# EAGLE design untitled (EAGLE 9.5.2)
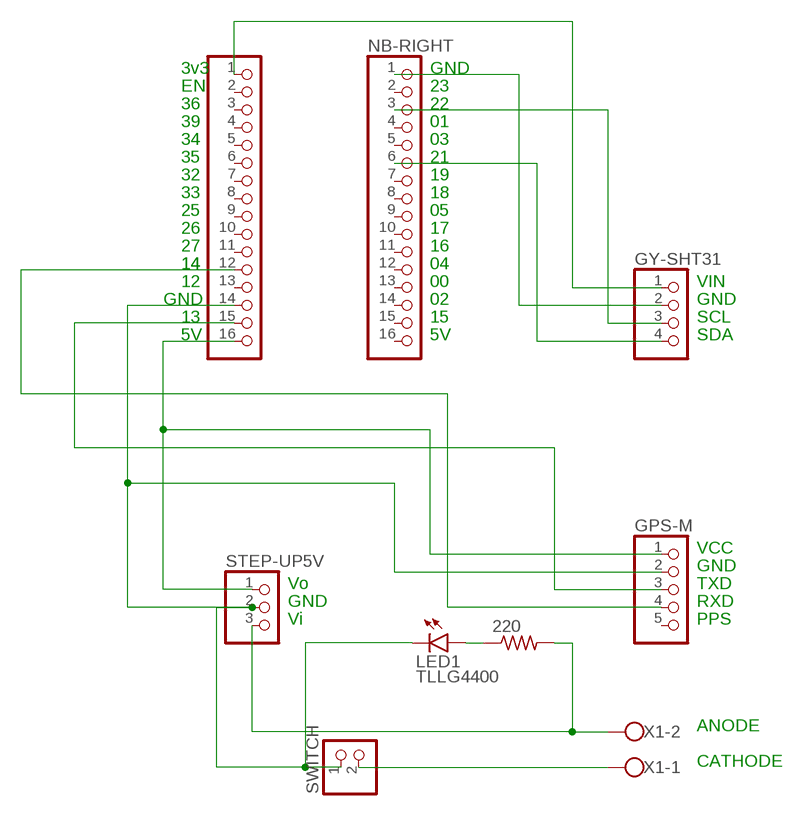
[diagram p0: schematic, sheet 1]

## Parts
220  R-US_0204/7  [0204/7]
GPS-M  PINHD-1X5  [1X05]
GY-SHT31  PINHD-1X4  [1X04]
LED1  TLLG4400  [LED3MM]
NB-LEFT  PINHD-1X16  [1X16]
NB-RIGHT  PINHD-1X16  [1X16]
STEP-UP5V  PINHD-1X3  [1X03]
SWITCH  PINHD-1X2  [1X02]
X1  W237-102  [W237-102]

## Nets
N$1: SWITCH.2 X1.1
N$2: 220.1 LED1.A
N$3: 220.2 STEP-UP5V.3 X1.2
N$4: GPS-M.2 LED1.K(C) NB-LEFT.14 STEP-UP5V.2 SWITCH.1
N$5: GY-SHT31.4 NB-RIGHT.6
N$6: GPS-M.1 NB-LEFT.16 STEP-UP5V.1
N$7: GPS-M.3 NB-LEFT.15
N$8: GPS-M.4 NB-LEFT.12
N$9: GY-SHT31.1 NB-LEFT.1
N$10: GY-SHT31.3 NB-RIGHT.3
N$11: GY-SHT31.2 NB-RIGHT.1
Unconnected: GPS-M.5 NB-LEFT.2 NB-LEFT.3 NB-LEFT.4 NB-LEFT.5 NB-LEFT.6 NB-LEFT.7 NB-LEFT.8 NB-LEFT.9 NB-LEFT.10 NB-LEFT.11 NB-LEFT.13 NB-RIGHT.2 NB-RIGHT.4 NB-RIGHT.5 NB-RIGHT.7 NB-RIGHT.8 NB-RIGHT.9 NB-RIGHT.10 NB-RIGHT.11 NB-RIGHT.12 NB-RIGHT.13 NB-RIGHT.14 NB-RIGHT.15 NB-RIGHT.16

## Notes on the sheet
- 3v3 | GND
- EN | 23
- 36 | 22
- 39 | 01
- 34 | 03
- 35 | 21
- 32 | 19
- 33 | 18
- 25 | 05
- 26 | 17
- 27 | 16
- 14 | 14 | 04
- 12 | 00 | VIN
- GND | 02 | GND
- 13 | 15 | SCL
- 5V | 5V | SDA
- VCC
- GND
- Vo | TXD
- GND | RXD
- Vi | PPS
- ANODE
- CATHODE

## Library data of the parts
220 = rcl:R-US_: RESISTOR, American symbol; SPICEPREFIX: R
GPS-M = pinhead:PINHD-1X5: PIN HEADER
GY-SHT31 = pinhead:PINHD-1X4: PIN HEADER
LED1 = led:TLLG4400: Low Current (2mA) LED 3 mm Tinted Diffused Package color GREEN Source: Data sheet <http://www.farnell.com/datasheets/391098.pdf>; MF: VISHAY SEMICONDUCTOR; OC_FARNELL: 1612435
NB-LEFT NB-RIGHT = pinhead:PINHD-1X16: PIN HEADER
STEP-UP5V = pinhead:PINHD-1X3: PIN HEADER
SWITCH = pinhead:PINHD-1X2: PIN HEADER
X1 = con-wago-500:W237-102: WAGO SCREW CLAMP; MPN: 237-102; OC_FARNELL: unknown; OC_NEWARK: 70K9898

## Board
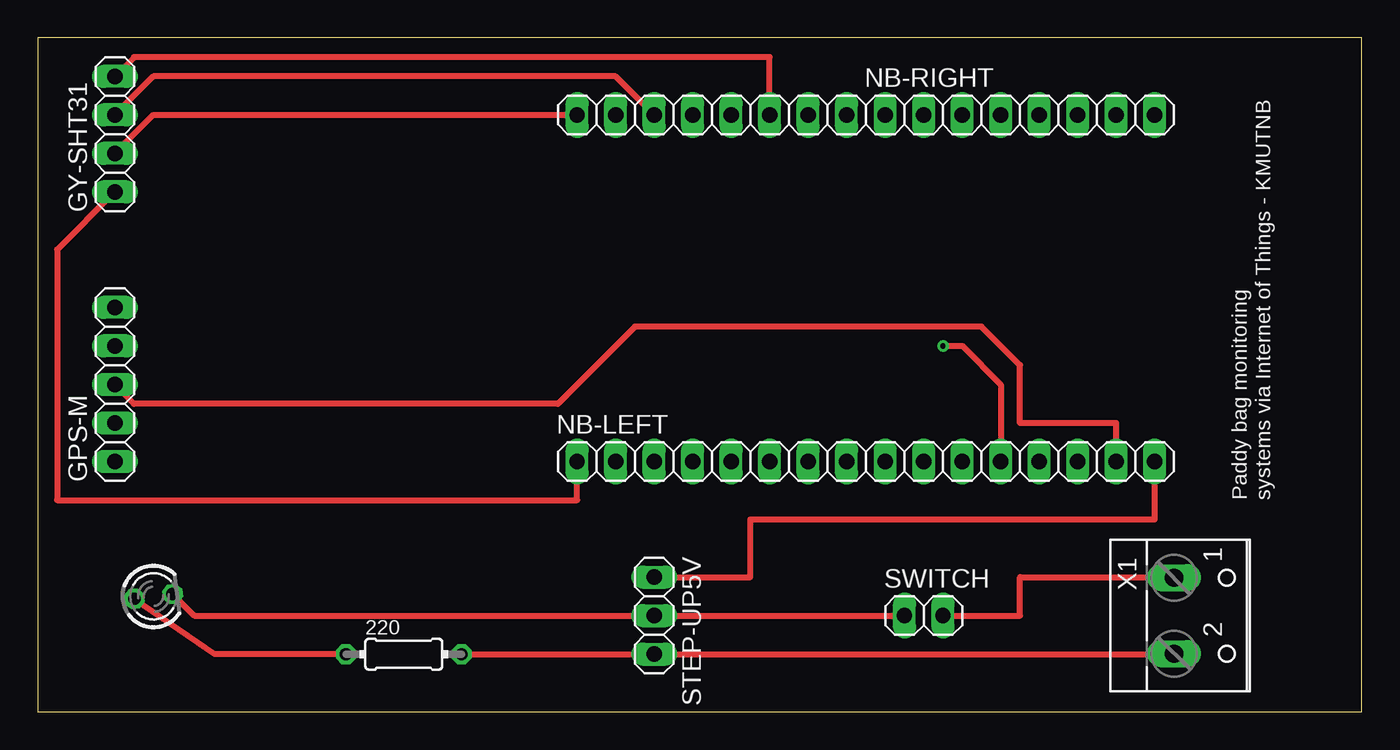
[diagram p1: board, top side]
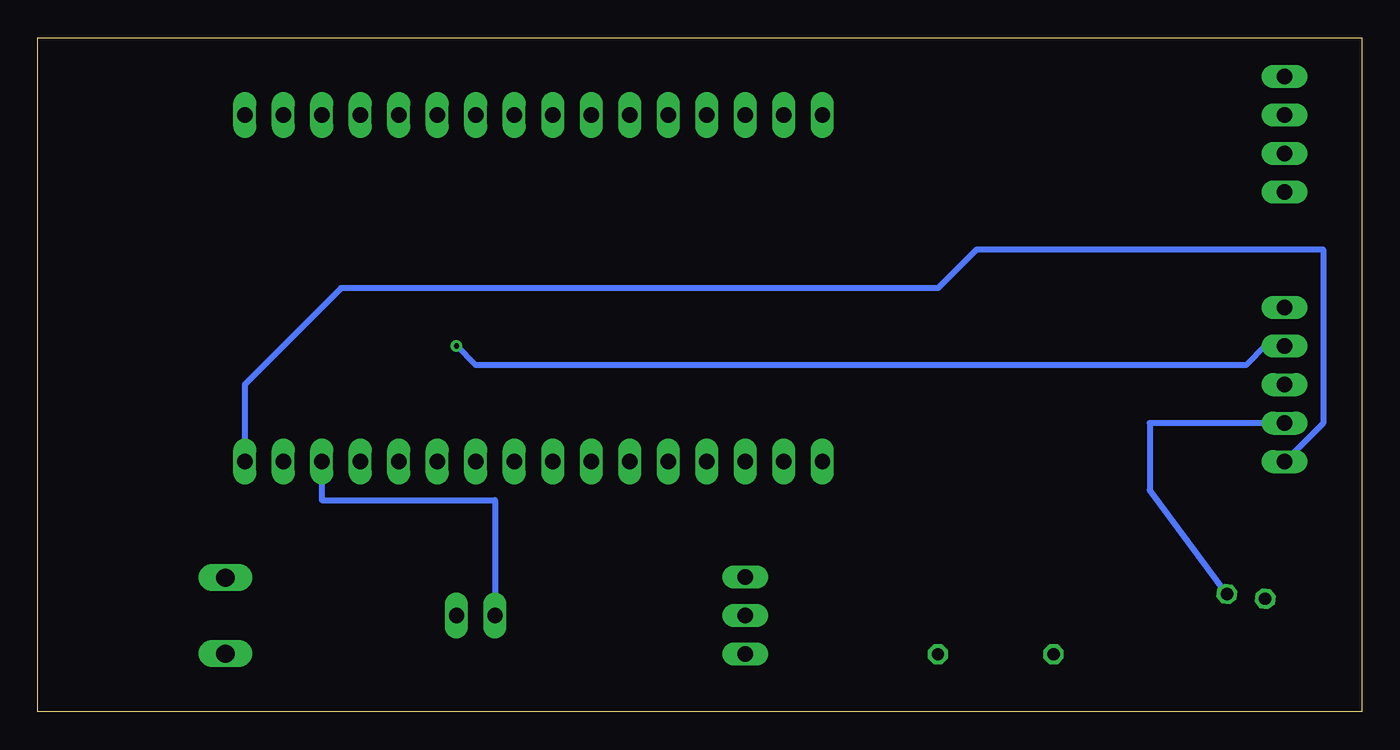
[diagram p2: board, bottom side, seen from below]

Size 87.3 x 44.44 mm. Coordinates in mm from the lower left corner, seen from the top.
Outline: 0,0 87.3,0 87.3,44.44 0,44.44 0,0
Copper layers (1*16): Top 0.035mm / dielectric 1.5mm / Bottom 0.035mm
Design rules "default": minimum track width 6mil, minimum drill 0.35mm, track to track 6mil, track to pad 6mil, pad to pad 6mil, via to via 6mil, smd to smd 6mil, copper to edge 40mil, drill to drill 6mil, minimum pad ring 10mil, minimum via ring 8mil, stop-mask expansion 4mil, vias tented up to drill 0mil, thermal gap 10mil

### Footprints (pad centres in the part's own frame; a part is rotated, then mirrored left to right if it is on the bottom)
0204/7 = drill 0.813 octagon: 1 -3.81,0; 2 3.81,0
1X05 = drill 1.016 long: 1 -5.08,0; 2 -2.54,0; 3 0,0; 4 2.54,0; 5 5.08,0
1X04 = drill 1.016 long: 1 -3.81,0; 2 -1.27,0; 3 1.27,0; 4 3.81,0
LED3MM = drill 0.813 octagon: A -1.27,0; K 1.27,0
1X16 = drill 1.016 long: 1 -19.05,0; 2 -16.51,0; 3 -13.97,0; 4 -11.43,0; 5 -8.89,0; 6 -6.35,0; 7 -3.81,0; 8 -1.27,0; 9 1.27,0; 10 3.81,0; 11 6.35,0; 12 8.89,0; 13 11.43,0; 14 13.97,0; 15 16.51,0; 16 19.05,0
1X03 = drill 1.016 long: 1 -2.54,0; 2 0,0; 3 2.54,0
1X02 = drill 1.016 long: 1 -1.27,0; 2 1.27,0
W237-102 = drill 1.194 long: 1 -2.5,-1.27; 2 2.5,-1.27

### Placement (x,y rotation side)
220  24.13,3.81 0 top
GPS-M  5.08,21.59 90 top
GY-SHT31  5.08,38.1 90 top
LED1  7.62,7.62 7.1 top
NB-LEFT  54.61,16.51 0 top
NB-RIGHT  54.61,39.37 0 top
STEP-UP5V  40.64,6.35 270 top
SWITCH  58.42,6.35 0 top
X1  76.2,6.35 270 top

### Tracks (layer width: path | path; a pad name or v marks a point on that pad's centre or on a via)
N$1
  Top 0.406: SWITCH.2 64.77,6.35 64.77,8.89 74.93,8.89 X1.1
N$2
  Top 0.406: 220.1 11.68,3.81 LED1.A
N$3
  Top 0.406: 220.2 STEP-UP5V.3 74.89,3.81 X1.2
N$4
  Top 0.406: LED1.K 10.31,6.35 STEP-UP5V.2 SWITCH.1
  Bottom 0.406: GPS-M.2 13.97,19.05 13.97,14.63 LED1.K | NB-LEFT.14 68.58,13.97 57.15,13.97 SWITCH.1
N$5
  Top 0.406: NB-RIGHT.6 48.26,43.18 6.35,43.18 GY-SHT31.4
N$6
  Top 0.406: STEP-UP5V.1 46.99,8.89 46.99,12.7 73.66,12.7 NB-LEFT.16
  Bottom 0.406: GPS-M.1 2.54,19.05 2.54,30.48 25.4,30.48 27.94,27.94 67.31,27.94 73.66,21.59 NB-LEFT.16
N$7
  Top 0.406: NB-LEFT.15 71.12,19.05 64.77,19.05 64.77,22.86 62.23,25.4 39.37,25.4 34.29,20.32 6.35,20.32 GPS-M.3
N$8  (via drill 0.35)
  Top 0.406: NB-LEFT.12 63.5,21.59 60.96,24.13 v59.69,24.13
  Bottom 0.406: GPS-M.4 6.35,24.13 7.62,22.86 58.42,22.86 v59.69,24.13
N$9
  Top 0.406: GY-SHT31.1 1.27,30.48 1.27,13.97 35.56,13.97 NB-LEFT.1
N$10
  Top 0.406: NB-RIGHT.3 38.1,41.91 7.62,41.91 GY-SHT31.3
N$11
  Top 0.406: GY-SHT31.2 7.62,39.37 NB-RIGHT.1

### Text on the board
tPlace: Paddy bag monitoring / systems via Internet of Things - KMUTNB